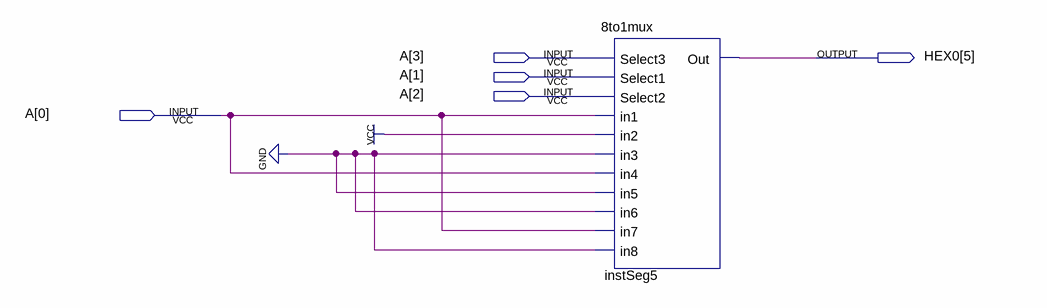
[diagram p0: schematic sheet]
// Quartus schematic seg5.bdf as structural Verilog: 1 symbols, 5 pins
module seg5 (
  input  [3:0] A,
  output [5:5] HEX0
);

  \8to1mux  instSeg5 (
    .Select3(A[3]), .Select1(A[1]), .Select2(A[2]), .in1(A[0]), .in2(1'b1), .in3(1'b0), .in4(A[0]),
    .in5(1'b0), .in6(1'b0), .in7(A[0]), .in8(1'b0), .Out(HEX0[5]));
endmodule
